# Altium schematic sheet base.SchDoc
size A4; SheetNumber: 2; SheetTotal: 3
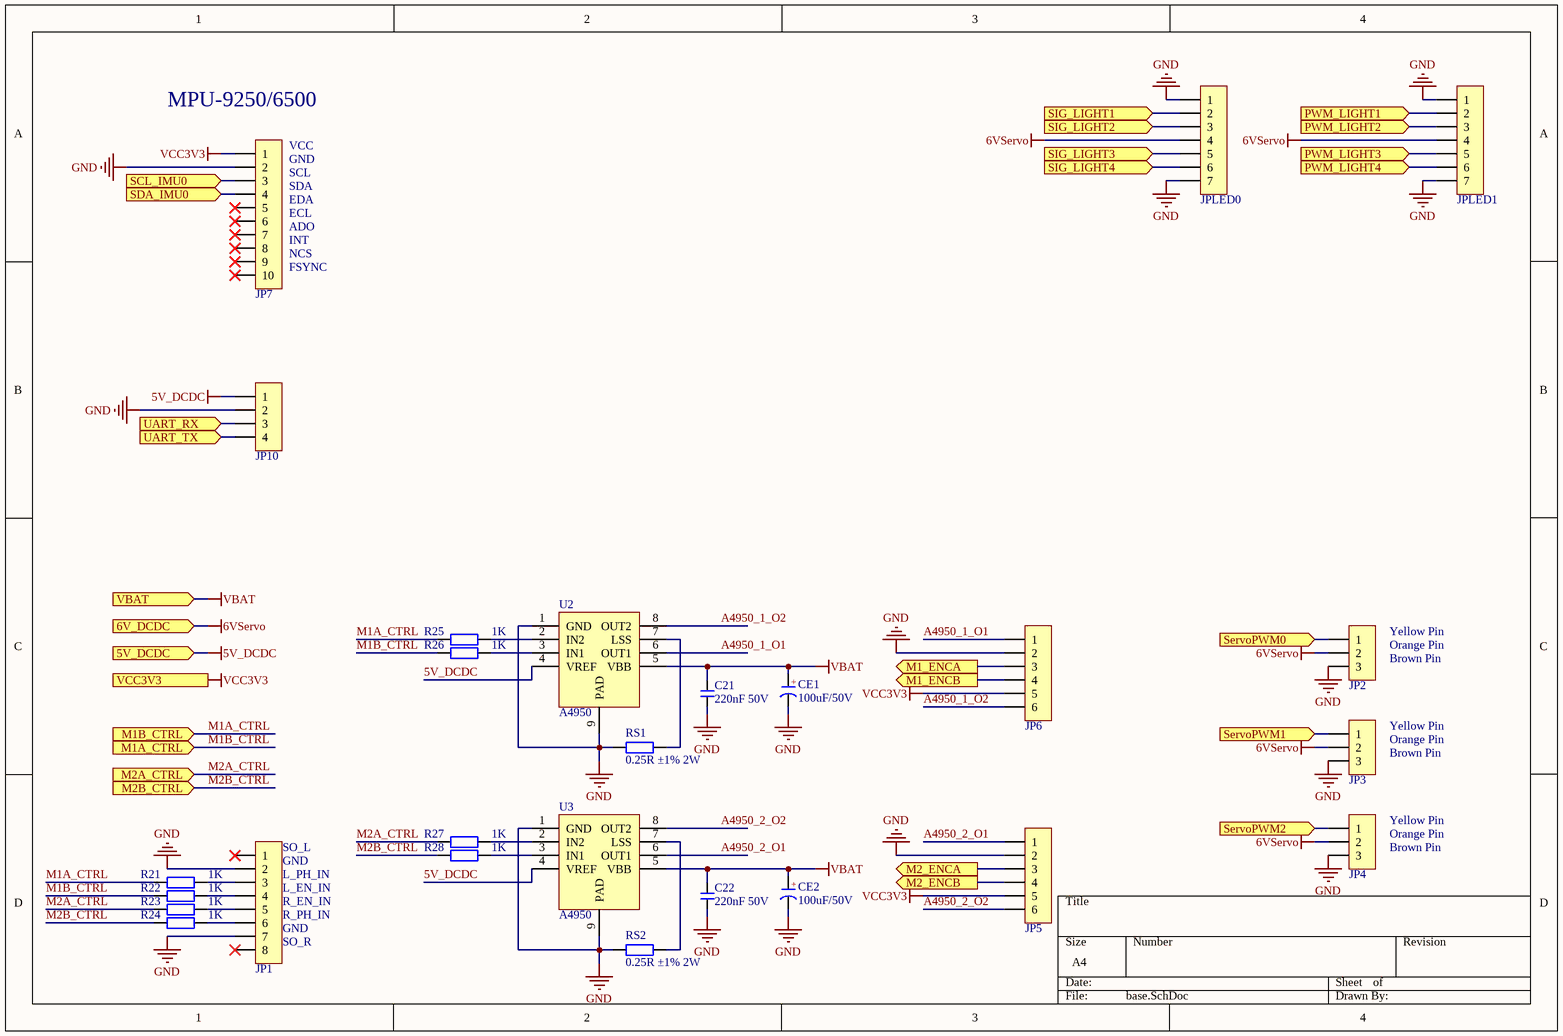
[diagram p0: base.SchDoc]

## Parts
C21  220nF 50V  [C 0603_M]
C22  220nF 50V  [C 0603_M]
CE1  100uF/50V  [CM E(8*10.2)]
CE2  100uF/50V  [CM E(8*10.2)]
JP1  HDR-1X8  [MX 1.25-LI-8P]  (value not drawn)
JP2  HDR-1X3  [HDR2.54-LI-3P]  (value not drawn)
JP3  HDR-1X3  [HDR2.54-LI-3P]  (value not drawn)
JP4  HDR-1X3  [HDR2.54-LI-3P]  (value not drawn)
JP5  HDR-1X6  [XH2.54-LI-6P]  (value not drawn)
JP6  HDR-1X6  [XH2.54-LI-6P]  (value not drawn)
JP7  HDR-1X10  [HDR2.54-M-LI-10P]  (value not drawn)
JP10  HDR-1X4  [HDR2.54-LI-4P]  (value not drawn)
JPLED0  HDR-1X7  [XH2.54-LI-7P]  (value not drawn)
JPLED1  HDR-1X7  [XH2.54-LI-7P]  (value not drawn)
R21  1K  [R 0402_M]
R22  1K  [R 0402_M]
R23  1K  [R 0402_M]
R24  1K  [R 0402_M]
R25  1K  [R 0402_M]
R26  1K  [R 0402_M]
R27  1K  [R 0402_M]
R28  1K  [R 0402_M]
RS1  0.25R ±1% 2W  [R 2512_M]
RS2  0.25R ±1% 2W  [R 2512_M]
U2  A4950  [A4950]
U3  A4950  [A4950]

## Ports
5V_DCDC (in), 6V_DCDC (in), M1_ENCA (out), M1_ENCB (out), M1A_CTRL (in), M1B_CTRL (in), M2_ENCA (out), M2_ENCB (out), M2A_CTRL (in), M2B_CTRL (in), PWM_LIGHT1 (in), PWM_LIGHT2 (in), PWM_LIGHT3 (in), PWM_LIGHT4 (in), SCL_IMU0 (in), SDA_IMU0 (in), ServoPWM0 (in), ServoPWM1 (in), ServoPWM2 (in), SIG_LIGHT1 (in), SIG_LIGHT2 (in), SIG_LIGHT3 (in), SIG_LIGHT4 (in), UART_RX (in), UART_TX (in), VBAT (in), VCC3V3 (in)

## Nets
5V_DCDC: JP10.1 U2.4(VREF) U3.4(VREF) ; port 5V_DCDC
6VServo: JP2.2 JP3.2 JP4.2 JPLED0.4 JPLED1.4 ; port 6V_DCDC
GND: C21.1 C22.1 CE1.2(K) CE2.2(K) JP1.2 JP1.7 JP2.3 JP3.3 JP4.3 JP5.2 JP6.2 JP7.2 JP10.2 JPLED0.1 JPLED0.7 JPLED1.1 JPLED1.7 RS1.1 RS2.1 U2.1(GND) U2.9(PAD) U3.1(GND) U3.9(PAD)
VBAT: C21.2 C22.2 CE1.1(A) CE2.1(A) U2.5(VBB) U3.5(VBB) ; port VBAT
VCC3V3: JP5.5 JP6.5 JP7.1 ; port VCC3V3
A4950_1_O1: JP6.1 U2.6(OUT1)
A4950_1_O2: JP6.6 U2.8(OUT2)
A4950_2_O1: JP5.1 U3.6(OUT1)
A4950_2_O2: JP5.6 U3.8(OUT2)
M1_ENCA: JP6.3 ; port M1_ENCA
M1_ENCB: JP6.4 ; port M1_ENCB
M1A_CTRL: R21.1 R25.1 ; port M1B_CTRL
M1B_CTRL: R22.1 R26.1 ; port M1A_CTRL
M2_ENCA: JP5.3 ; port M2_ENCA
M2_ENCB: JP5.4 ; port M2_ENCB
M2A_CTRL: R23.1 R27.1 ; port M2A_CTRL
M2B_CTRL: R24.1 R28.1 ; port M2B_CTRL
PWM_LIGHT1: JPLED1.2 ; port PWM_LIGHT1
PWM_LIGHT2: JPLED1.3 ; port PWM_LIGHT2
PWM_LIGHT3: JPLED1.5 ; port PWM_LIGHT3
PWM_LIGHT4: JPLED1.6 ; port PWM_LIGHT4
SCL_IMU0: JP7.3 ; port SCL_IMU0
SDA_IMU0: JP7.4 ; port SDA_IMU0
ServoPWM0: JP2.1 ; port ServoPWM0
ServoPWM1: JP3.1 ; port ServoPWM1
ServoPWM2: JP4.1 ; port ServoPWM2
SIG_LIGHT1: JPLED0.2 ; port SIG_LIGHT1
SIG_LIGHT2: JPLED0.3 ; port SIG_LIGHT2
SIG_LIGHT3: JPLED0.5 ; port SIG_LIGHT3
SIG_LIGHT4: JPLED0.6 ; port SIG_LIGHT4
UART_RX: JP10.3 ; port UART_RX
UART_TX: JP10.4 ; port UART_TX
NetJP1_3: JP1.3 R21.2
NetJP1_4: JP1.4 R22.2
NetJP1_5: JP1.5 R23.2
NetJP1_6: JP1.6 R24.2
NetR25_2: R25.2 U2.2(IN2)
NetR26_2: R26.2 U2.3(IN1)
NetR27_2: R27.2 U3.2(IN2)
NetR28_2: R28.2 U3.3(IN1)
NetRS1_2: RS1.2 U2.7(LSS)
NetRS2_2: RS2.2 U3.7(LSS)

Not connected (* = marked no-connect by the designer): JP1 1* 8*; JP7 5* 6* 7* 8* 9* 10*

## Notes on the sheet
- (near JP7) MPU-9250/6500
- (near JP7) VCC
- (near JP7) GND
- (near JP7) SCL
- (near JP7) SDA
- (near JP7) EDA
- (near JP7) ECL
- (near JP7) ADO
- (near JP7) INT
- (near JP7) NCS
- (near JP7) FSYNC
- (near JP2) Yellow Pin
- (near JP2) Orange Pin
- (near JP2) Brown Pin
- (near JP3) Yellow Pin
- (near JP3) Orange Pin
- (near JP3) Brown Pin
- (near JP1) SO_L
- (near JP4) Yellow Pin
- (near JP4) Orange Pin
- (near JP4) Brown Pin
- (near JP1) GND
- (near JP1) L_PH_IN
- (near JP1) L_EN_IN
- (near JP1) R_EN_IN
- (near JP1) R_PH_IN
- (near JP1) SO_R
- (in symbol CE_SMD) +

## Library data of the parts
C21 C22 = C: 贴片电容
CE1 CE2 = CE_SMD: 贴片电解电容
JP1 = Header 8_1.25: 8P接插件
JP2-JP4 = Header 3: 3P接插件
JP5 JP6 = Header 6: 6P接插件; 版权归属: 封装库来自淘宝 ID：黄晶宝石; BOM名称: 6P接插件; 学习资源: https://shop463601444.taobao.com
JP7 = Header 10: 10P接插件
JP10 = Header 4: 4P接插件; 版权归属: 封装库来自淘宝 ID：黄晶宝石; BOM名称: 4P接插件; 学习资源: https://shop463601444.taobao.com
JPLED0 = Header 7: 7P接插件; 版权归属: 封装库来自淘宝 ID：黄晶宝石; BOM名称: 7P接插件; 学习资源: https://shop463601444.taobao.com
JPLED1 = Header 7: 7P接插件
R21-R28 RS1 RS2 = R: 贴片电阻
U2 U3 = A4950: Full-Bridge DMOS PWM Motor Driver